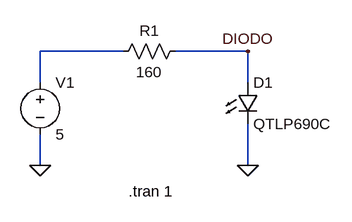
[diagram p0: schematic diodo-led.asc]
diodo-led.asc, the LTspice schematic file:
Version 4
SHEET 1 880 680
WIRE 128 112 0 112
WIRE 320 112 208 112
WIRE 0 160 0 112
WIRE 320 160 320 112
WIRE 0 288 0 240
WIRE 320 288 320 224
FLAG 320 288 0
FLAG 0 288 0
FLAG 320 112 DIODO
SYMBOL LED 304 160 R0
SYMATTR InstName D1
SYMATTR Value QTLP690C
SYMATTR Description Diode
SYMATTR Type diode
SYMBOL voltage 0 144 R0
WINDOW 123 0 0 Left 0
WINDOW 39 0 0 Left 0
SYMATTR InstName V1
SYMATTR Value 5
SYMBOL res 224 96 R90
WINDOW 0 0 56 VBottom 2
WINDOW 3 32 56 VTop 2
SYMATTR InstName R1
SYMATTR Value 160
TEXT 136 328 Left 2 !.tran 1

The netlist it stands for:
* diodo-led.asc
D1 DIODO 0 QTLP690C
V1 N001 0 5
R1 DIODO N001 160
.model D D
.lib standard.dio
.tran 1
.backanno
.end